# EAGLE design robotWagen_arrduino (EAGLE 9.6.2)
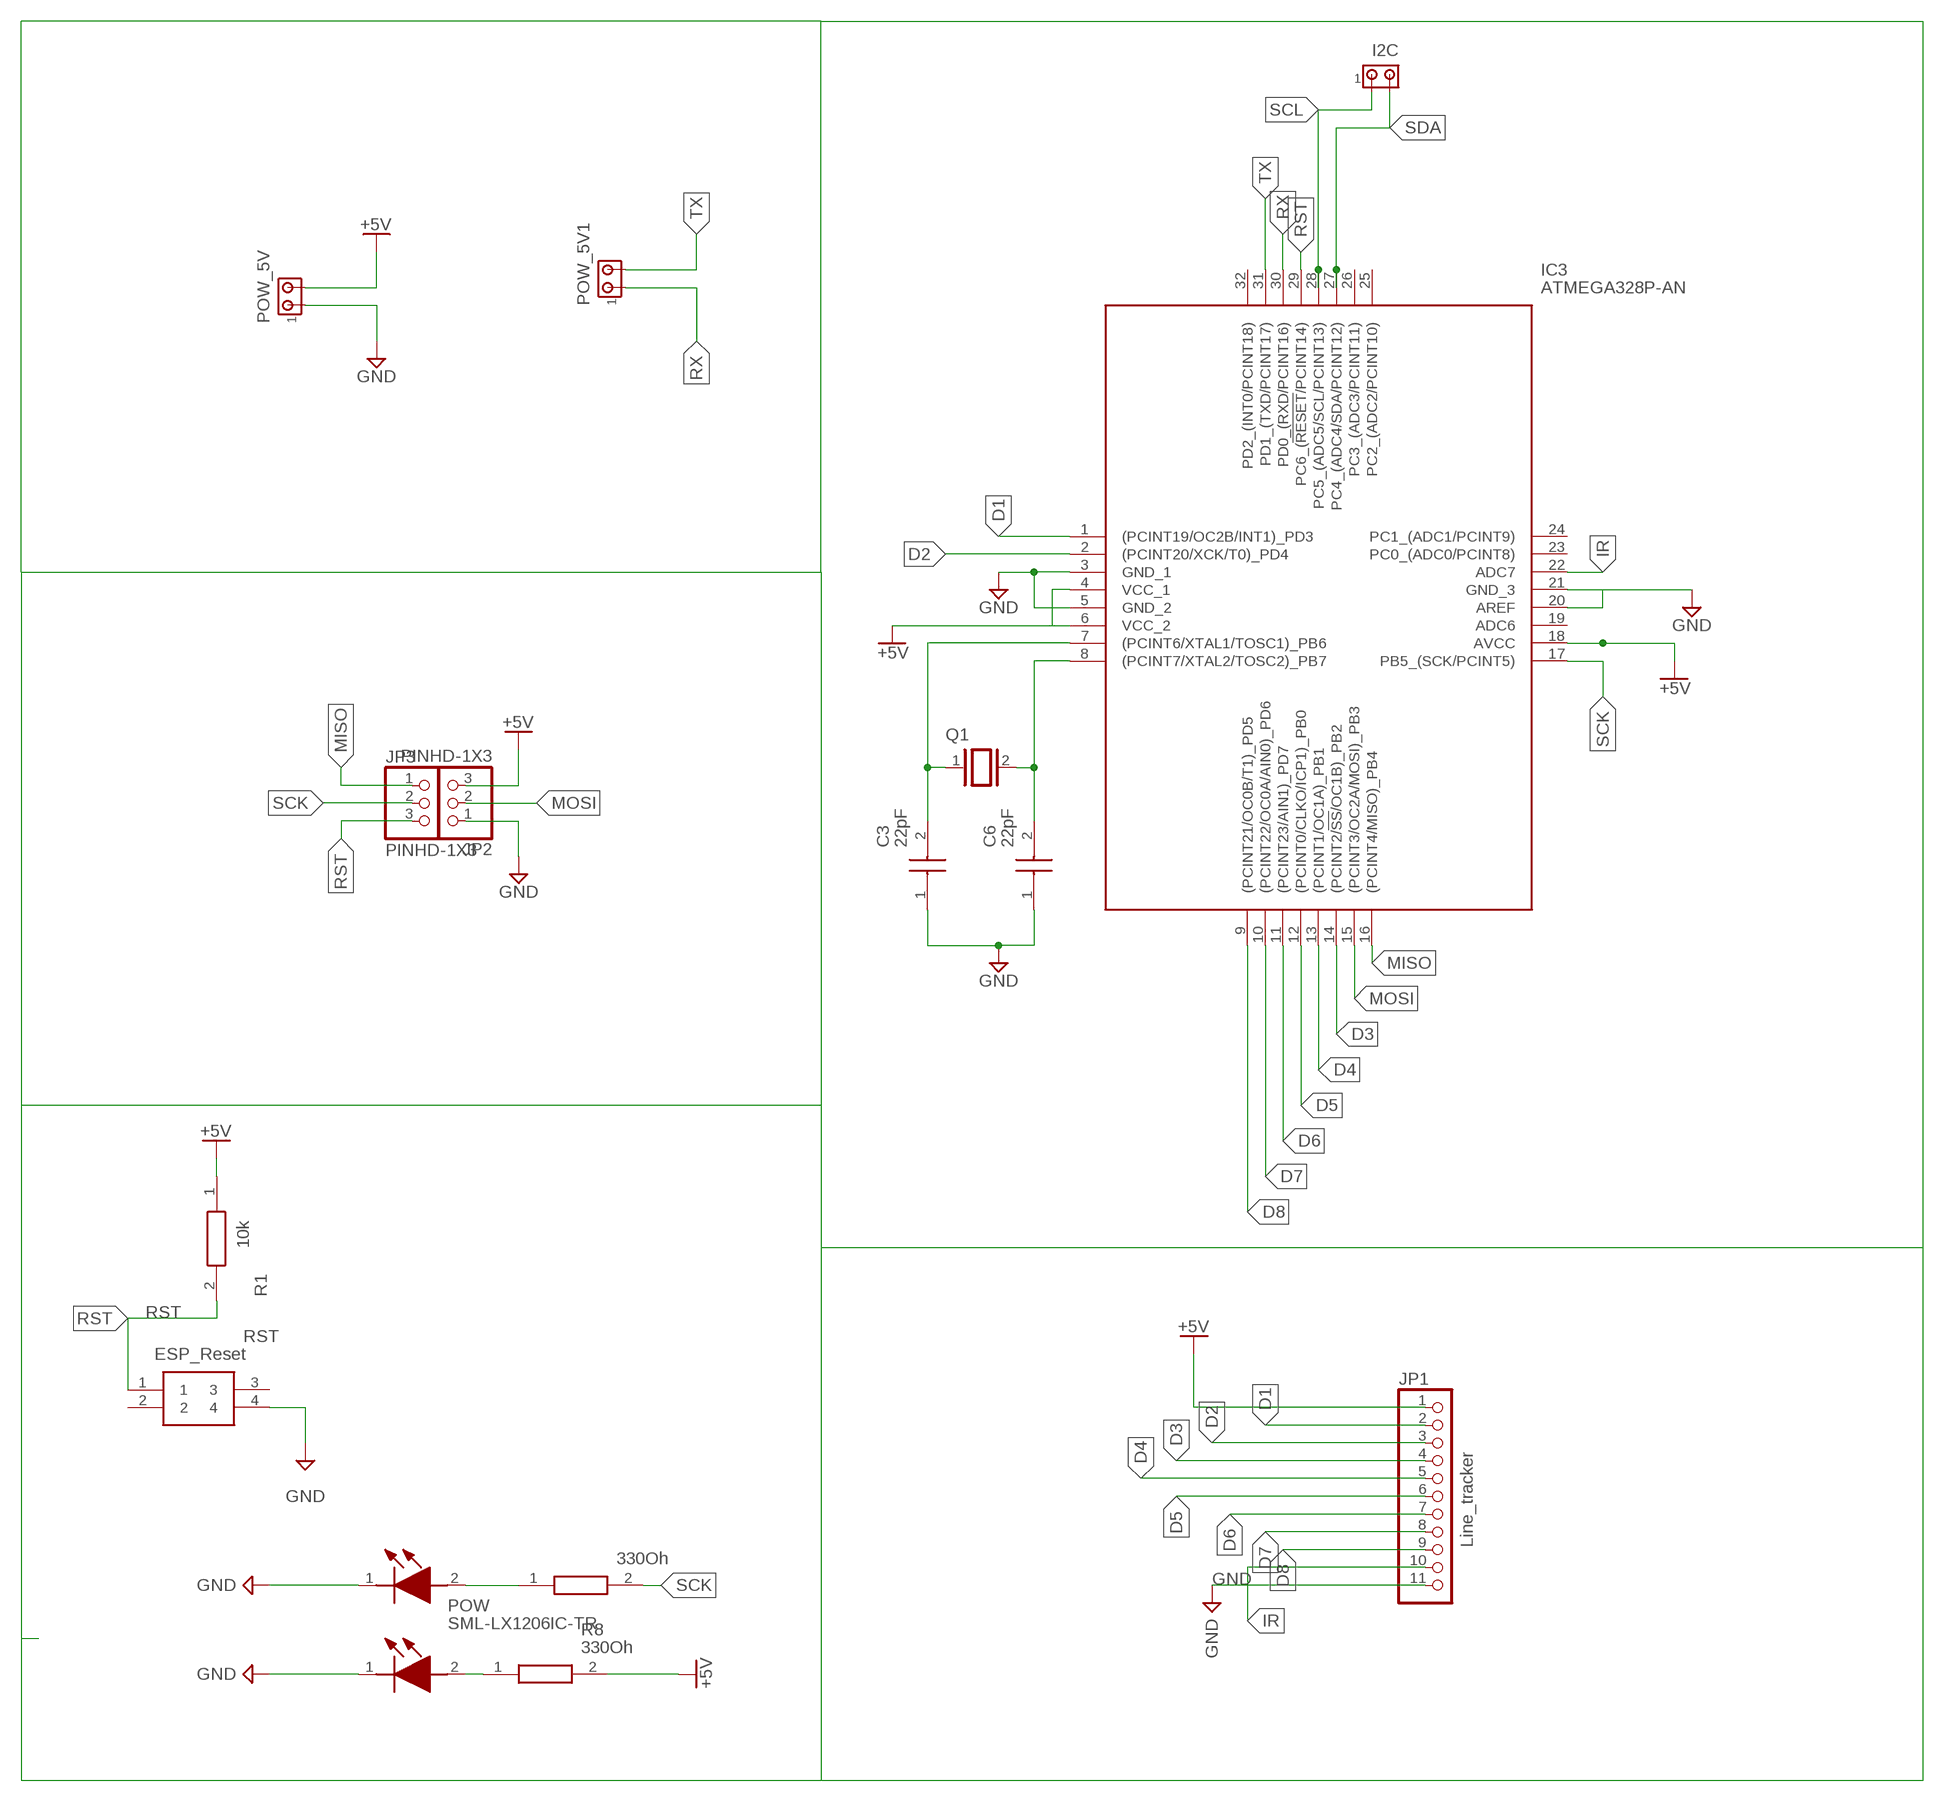
[diagram p0: schematic, sheet 1]

## Parts
C3  22pF  GRM21BR71H104JA01L  [CAPC2012X145N]
C6  22pF  GRM21BR71H104JA01L  [CAPC2012X145N]
I2C  MTA02-156  [1X2MTA]
IC3  ATMEGA328P-AN  [QFP80P900X900X120-32N]
JP1  Line_tracker  PINHD-1X11  [1X11]
JP2  PINHD-1X3  [1X03]
JP3  PINHD-1X3  [1X03]
POW  SML-LX1206IC-TR  [SMLLX1206ICTR]
POW_5V  MTA02-156  [1X2MTA]
POW_5V1  MTA02-156  [1X2MTA]
Q1  XTAL/S  [QS]
R1  10k  MCWR08X3301FTL  [RESC2012X65N]
R7  330Oh  MCWR08X3301FTL  [RESC2012X65N]
R8  330Oh  MCWR08X3301FTL  [RESC2012X65N]
RST  ESP_Reset  430182050816  [430182070816]
TX  SML-LX1206IC-TR  [SMLLX1206ICTR]

## Nets
+5V [power]: IC3.4(VCC_1) IC3.6(VCC_2) IC3.18(AVCC) JP1.1 JP2.3 POW_5V.2 R1.1 R8.2
D1: IC3.1((PCINT19/OC2B/INT1)_PD3) JP1.2
D2: IC3.2((PCINT20/XCK/T0)_PD4) JP1.3
D3: IC3.14((PCINT2/!SS!/OC1B)_PB2) JP1.4
D4: IC3.13((PCINT1/OC1A)_PB1) JP1.5
D5: IC3.12((PCINT0/CLKO/ICP1)_PB0) JP1.6
D6: IC3.11((PCINT23/AIN1)_PD7) JP1.7
D7: IC3.10((PCINT22/OC0A/AIN0)_PD6) JP1.8
D8: IC3.9((PCINT21/OC0B/T1)_PD5) JP1.9
GND [power]: C3.1 C6.1 IC3.3(GND_1) IC3.5(GND_2) IC3.20(AREF) IC3.21(GND_3) JP1.11 JP2.1 POW.1(K) POW_5V.1 RST.4 TX.1(K)
IR: IC3.22(ADC7) JP1.10
MISO: IC3.16((PCINT4/MISO)_PB4) JP3.1
MOSI: IC3.15((PCINT3/OC2A/MOSI)_PB3) JP2.2
N$2: POW.2(A) R8.1
N$3: C3.2 IC3.7((PCINT6/XTAL1/TOSC1)_PB6) Q1.1
N$5: C6.2 IC3.8((PCINT7/XTAL2/TOSC2)_PB7) Q1.2
RST: IC3.29(PC6_(!RESET!/PCINT14)) JP3.3 R1.2 RST.1
RX: IC3.30(PD0_(RXD/PCINT16)) POW_5V1.1
SCK: IC3.17(PB5_(SCK/PCINT5)) JP3.2 R7.2
SCL: I2C.1 IC3.28(PC5_(ADC5/SCL/PCINT13))
SDA: I2C.2 IC3.27(PC4_(ADC4/SDA/PCINT12))
TX: IC3.31(PD1_(TXD/PCINT17)) POW_5V1.2
TX1: R7.1 TX.2(A)
Unconnected: IC3.19(ADC6) IC3.23(PC0_(ADC0/PCINT8)) IC3.24(PC1_(ADC1/PCINT9)) IC3.25(PC2_(ADC2/PCINT10)) IC3.26(PC3_(ADC3/PCINT11)) IC3.32(PD2_(INT0/PCINT18)) RST.2 RST.3

## Library data of the parts
C3 C6 = GRM21BR71H104JA01L:GRM21BR71H104JA01L: Multilayer Ceramic Capacitors MLCC - SMD/SMT 0805 0.1uF 50volts X7R 5% Source: Datasheet <https://datasheet.datasheetarchive.com/originals/distributors/DKDS-10/192129.pdf>; ARROW_PART_NUMBER: GRM21BR71H104JA01L; ARROW_PRICE-STOCK: https://www.arrow.com/en/products/grm21br71h104ja01l/murata-manufacturing; DESCRIPTION: Multilayer Ceramic Capacitors MLCC - SMD/SMT 0805 0.1uF 50volts X7R 5%; HEIGHT: 1.45mm; MANUFACTURER_NAME: Murata Electronics; MANUFACTURER_PART_NUMBER: GRM21BR71H104JA01L; MOUSER_PART_NUMBER: 81-GRM21BR71H104JA01; MOUSER_PRICE-STOCK: https://www.mouser.co.uk/ProductDetail/Murata-Electronics/GRM21BR71H104JA01L?qs=JovLnzPPZAIJJ5OSotNa3Q%3D%3D
I2C POW_5V POW_5V1 = con-amp:MTA02-156: AMP connector
IC3 = ATMEGA328P-AN:ATMEGA328P-AN: MCU 8-bit ATmega AVR RISC 32KB Flash Atmel ATMEGA328P-AN, 8bit AVR Microcontroller, 20MHz, 32 kB Flash, 32-Pin TQFP Source: Datasheet <https://datasheet.datasheetarchive.com/originals/distributors/Datasheets_SAMA/81e6b951babeaaddc9de6b0e081ba8bf.pdf>; ARROW_PART_NUMBER: ATMEGA328P-AN; ARROW_PRICE-STOCK: https://www.arrow.com/en/products/atmega328p-an/microchip-technology?region=nac; DESCRIPTION: MCU 8-bit ATmega AVR RISC 32KB Flash Atmel ATMEGA328P-AN, 8bit AVR Microcontroller, 20MHz, 32 kB Flash, 32-Pin TQFP; HEIGHT: 1.2mm; MANUFACTURER_NAME: Microchip; MANUFACTURER_PART_NUMBER: ATMEGA328P-AN; MOUSER_PART_NUMBER: 556-ATMEGA328P-AN; MOUSER_PRICE-STOCK: https://www.mouser.co.uk/ProductDetail/Microchip-Technology-Atmel/ATMEGA328P-AN?qs=6Dg1WZIWLC6WK556tw8xAw%3D%3D
JP1 = Connector:PINHD-1X11: PIN HEADER; CATEGORY: CONNECTOR; SUB-CATEGORY: PIN-HEADER
JP2 JP3 = Connector:PINHD-1X3: PIN HEADER; CATEGORY: CONNECTOR; SUB-CATEGORY: PIN-HEADER
POW TX = SML-LX1206IC-TR:SML-LX1206IC-TR: Standard LEDs - SMD 1206 Red Source: Datasheet <http://www.farnell.com/datasheets/1856081.pdf>; ARROW_PART_NUMBER: SML-LX1206IC-TR; ARROW_PRICE-STOCK: https://www.arrow.com/en/products/sml-lx1206ic-tr/lumex?region=nac; DESCRIPTION: Standard LEDs - SMD 1206 Red; HEIGHT: 1mm; MANUFACTURER_NAME: Lumex; MANUFACTURER_PART_NUMBER: SML-LX1206IC-TR; MOUSER_PART_NUMBER: 696-SML-LX1206IC; MOUSER_PRICE-STOCK: https://www.mouser.co.uk/ProductDetail/Lumex/SML-LX1206IC-TR?qs=vlknNxX0Xzgi3577r8SRWg%3D%3D
Q1 = special:XTAL/S: CRYSTAL
R1 R7 R8 = MCWR08X3301FTL:MCWR08X3301FTL: RES, 3K3, 1%, 0.125W, 0805, THICK FILM Source: Datasheet <http://www.farnell.com/datasheets/2563624.pdf>; DESCRIPTION: RES, 3K3, 1%, 0.125W, 0805, THICK FILM; HEIGHT: 0.65mm; MANUFACTURER_NAME: MULTICOMP; MANUFACTURER_PART_NUMBER: MCWR08X3301FTL
RST = 430182050816:430182050816: Black Tactile Tactile Switch, NO 50 mA 1.6mm Surface Mount Source: Datasheet <http://katalog.we-online.de/em/datasheet/4301x2xxx8x6.pdf>; DESCRIPTION: Black Tactile Tactile Switch, NO 50 mA 1.6mm Surface Mount; HEIGHT: mm; MANUFACTURER_NAME: Wurth Elektronik; MANUFACTURER_PART_NUMBER: 430182050816; MOUSER_PART_NUMBER: 710-430182050816; MOUSER_PRICE-STOCK: https://www.mouser.co.uk/ProductDetail/Wurth-Elektronik/430182050816?qs=wr8lucFkNMUyle0jQPgWGw%3D%3D

## Net classes
1 power: width 0.254 mm, clearance 0.254 mm

## Board
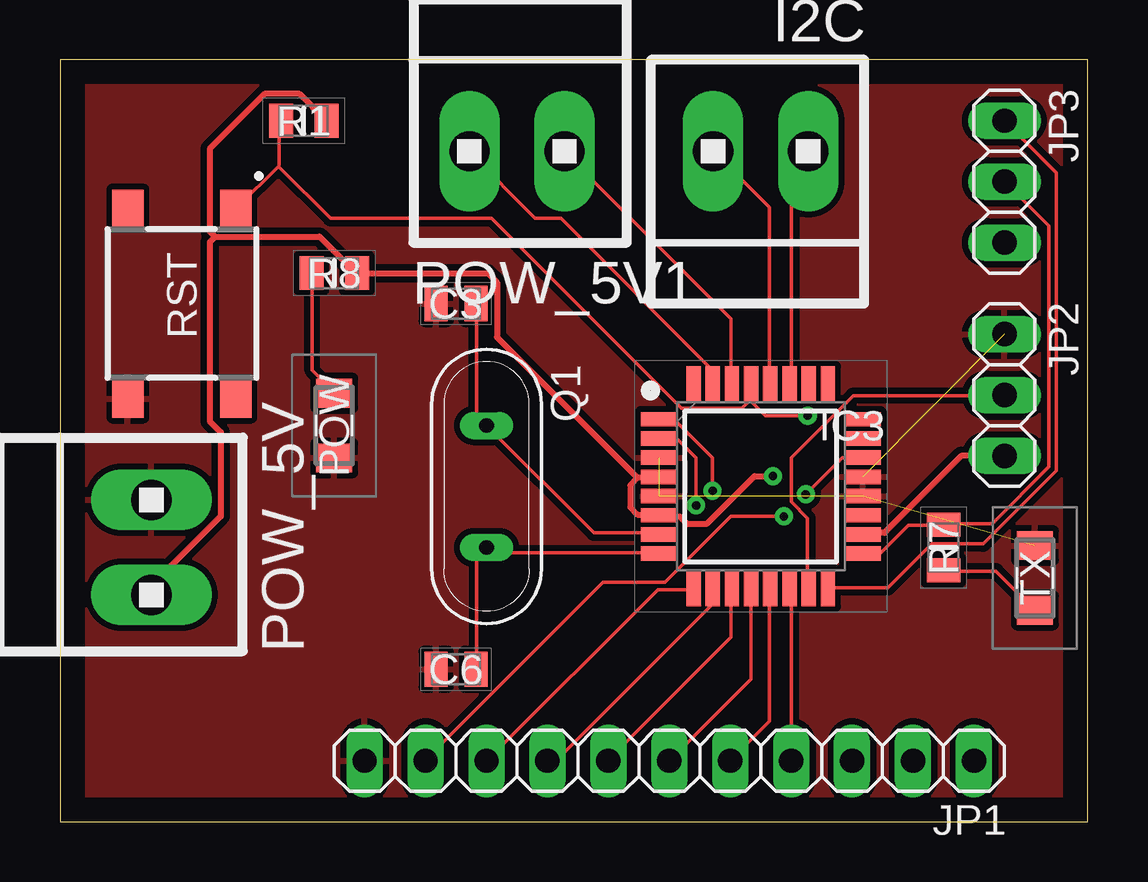
[diagram p1: board, top side]
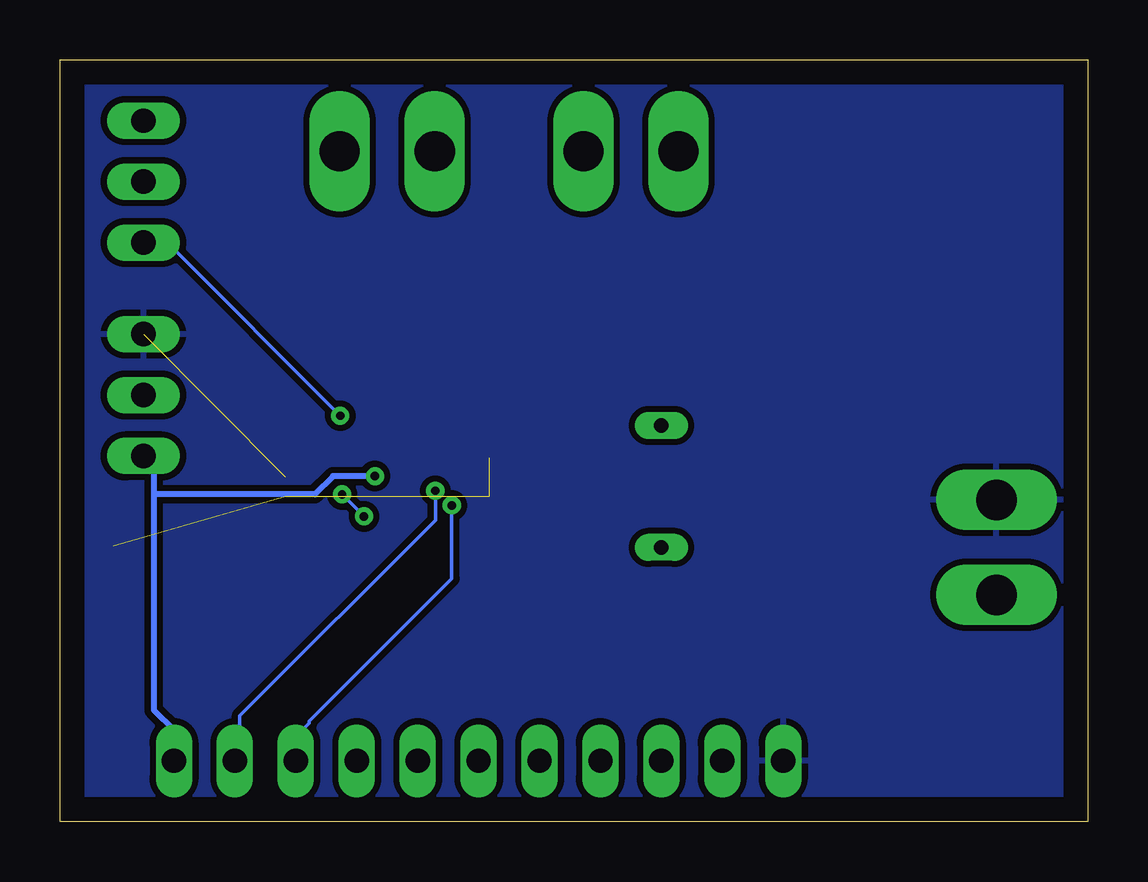
[diagram p2: board, bottom side, seen from below]

Size 42.85 x 31.74 mm. Coordinates in mm from the lower left corner, seen from the top.
Outline: 0,0 42.85,0 42.85,31.74 0,31.74 0,0
Copper layers (1*16): Top 0.035mm / dielectric 1.5mm / Bottom 0.035mm
Design rules "default": minimum track width 6mil, minimum drill 0.35mm, track to track 6mil, track to pad 6mil, pad to pad 6mil, via to via 6mil, smd to smd 6mil, copper to edge 40mil, drill to drill 6mil, minimum pad ring 10mil, minimum via ring 8mil, stop-mask expansion 4mil, vias tented up to drill 0mil, thermal gap 10mil

### Footprints (pad centres in the part's own frame; a part is rotated, then mirrored left to right if it is on the bottom)
CAPC2012X145N = smd 0.97 x 1.47: 1 -0.83,0; 2 0.83,0
1X2MTA = drill 1.676 long: 1 1.981,0; 2 -1.981,0
QFP80P900X900X120-32N = smd 1.5 x 0.6: 1 -4.25,2.8; 2 -4.25,2; 3 -4.25,1.2; 4 -4.25,0.4; 5 -4.25,-0.4; 6 -4.25,-1.2; 7 -4.25,-2; 8 -4.25,-2.8; 17 4.25,-2.8; 18 4.25,-2; 19 4.25,-1.2; 20 4.25,-0.4; 21 4.25,0.4; 22 4.25,1.2; 23 4.25,2; 24 4.25,2.8 | smd 0.6 x 1.5: 9 -2.8,-4.25; 10 -2,-4.25; 11 -1.2,-4.25; 12 -0.4,-4.25; 13 0.4,-4.25; 14 1.2,-4.25; 15 2,-4.25; 16 2.8,-4.25; 25 2.8,4.25; 26 2,4.25; 27 1.2,4.25; 28 0.4,4.25; 29 -0.4,4.25; 30 -1.2,4.25; 31 -2,4.25; 32 -2.8,4.25
1X11 = drill 1.016 long: 1 -12.7,0; 2 -10.16,0; 3 -7.62,0; 4 -5.08,0; 5 -2.54,0; 6 0,0; 7 2.54,0; 8 5.08,0; 9 7.62,0; 10 10.16,0; 11 12.7,0
1X03 = drill 1.016 long: 1 -2.54,0; 2 0,0; 3 2.54,0
SMLLX1206ICTR = smd 1.2 x 1.5: 1 -1.35,0; 2 1.35,0
QS = drill 0.61 long: 1 -2.54,0; 2 2.54,0
RESC2012X65N = smd 1 x 1.4: 1 -0.95,0; 2 0.95,0
430182070816 = smd 1.55 x 1.3: 1 -3.975,2.25; 2 -3.975,-2.25; 3 3.975,2.25; 4 3.975,-2.25

### Placement (x,y rotation side)
C3  16.51,21.59 0 top
C6  16.51,6.35 0 top
I2C  29.21,27.94 180 top
IC3  29.21,13.97 0 top
JP1  25.4,2.54 180 top
JP2  39.37,17.78 270 top
JP3  39.37,26.67 270 top
POW  11.43,16.51 90 top
POW_5V  3.81,11.43 90 top
POW_5V1  19.05,27.94 0 top
Q1  17.78,13.97 270 top
R1  10.16,29.21 180 top
R7  36.83,11.43 90 top
R8  11.43,22.86 0 top
RST  5.08,21.59 270 top
TX  40.64,10.16 270 top

### Tracks (layer width: path | path; a pad name or v marks a point on that pad's centre or on a via)
+5V  (via drill 0.35)
  Top 0.254: IC3.18 33.53,12.04 34.37,12.04 37.57,15.24 39.32,15.24 JP2.3 | 24.08,14.33 23.77,14.02 23.77,13.11 24.08,12.8 24.92,12.8 IC3.6 25.07,12.72 25.83,12.72 26.14,12.42 26.98,12.42 28.96,14.4 v29.72,14.4 | 24.08,14.33 24.92,14.33 IC3.4 | 6.48,24.38 10.82,24.38 12.34,22.86 R8.2 12.5,22.86 17.83,22.86 18.21,22.48 18.21,20.19 24,14.4 24.08,14.33 | 6.48,24.38 6.25,24.61 6.25,28.04 8.53,30.33 9.98,30.33 11.05,29.26 R1.1 | POW_5V.2 3.81,9.83 6.71,12.72 6.71,16.23 6.25,16.69 6.25,24.16 6.4,24.31 6.48,24.38
  Bottom 0.254: 38.94,13.64 38.94,14.86 39.32,15.24 JP2.3 | 38.94,13.64 38.94,4.65 38.1,3.81 38.1,2.59 JP1.1 | v29.72,14.4 31.47,14.4 32.23,13.64 38.86,13.64 38.94,13.64
D1  (via drill 0.35)
  Top 0.152: v27.2,13.79 27.2,15.16 25.6,16.76 24.99,16.76 IC3.1
  Bottom 0.152: v27.2,13.79 27.2,12.57 35.36,4.42 35.36,4.04 35.51,3.89 35.51,2.59 JP1.2
D2  (via drill 0.35)
  Top 0.152: v26.52,13.18 26.52,15.16 25.76,15.93 24.99,15.93 IC3.2
  Bottom 0.152: v26.52,13.18 26.52,10.13 32.46,4.19 32.46,4.12 32.99,3.58 32.99,2.59 JP1.3
D3
  Top 0.152: IC3.14 30.48,9.68 30.48,2.59 JP1.4
D4
  Top 0.152: IC3.13 29.57,9.68 29.57,4.19 27.96,2.59 JP1.5
D5
  Top 0.152: IC3.12 28.8,9.68 28.8,5.94 25.45,2.59 JP1.6
D6
  Top 0.152: IC3.11 27.96,9.68 27.96,7.7 22.86,2.59 JP1.7
D7
  Top 0.152: IC3.10 27.2,9.68 27.2,9.07 20.73,2.59 20.34,2.59 JP1.8
D8
  Top 0.152: IC3.9 26.36,9.68 24.92,9.68 17.83,2.59 JP1.9
GND  (4 unrouted)
  pour Top: 0,0 43.18,0 43.18,31.75 0,31.75
  pour Bottom: 0,0 43.18,0 43.18,31.75 0,31.75
IR  (via drill 0.35)
  Top 0.152: v31.09,13.64 32.61,15.16 IC3.22 | v30.18,12.72 27.96,12.72 25.22,9.98 22.63,9.98 15.24,2.59 JP1.10
  Bottom 0.152: v30.18,12.72 v31.09,13.64
MISO
  Top 0.152: IC3.16 32.08,9.75 34.52,9.75 36.35,11.58 38.48,11.58 41.53,14.63 41.53,27.05 39.4,29.18 JP3.1
MOSI
  Top 0.152: IC3.15 31.17,9.75 31.17,12.65 30.48,13.34 30.48,15.16 33.07,17.75 39.32,17.75 JP2.2
N$2
  Top 0.152: R8.1 10.52,22.86 10.52,18.82 11.43,17.91 POW.2
N$3
  Top 0.152: C3.2 17.37,21.57 17.37,16.92 17.75,16.54 Q1.1 17.83,16.46 22.25,12.04 24.92,12.04 IC3.7
N$5
  Top 0.152: C6.2 17.37,6.4 17.37,11.05 17.75,11.43 Q1.2 17.83,11.43 18.06,11.2 24.92,11.2 IC3.8
RST  (via drill 0.35)
  Top 0.152: 9.11,27.32 7.39,25.6 RST.1 | 9.11,27.32 9.14,27.36 9.14,29.18 R1.2 | 9.11,27.32 9.14,27.28 11.28,25.15 17.98,25.15 25.91,17.22 28.42,17.22 28.8,17.6 IC3.29 28.8,17.53 29.41,16.92 v31.17,16.92
  Bottom 0.152: v31.17,16.92 38.33,24.08 39.32,24.08 JP3.3
RX
  Top 0.152: IC3.30 27.96,18.29 27.96,20.95 21.03,27.89 POW_5V1.1
SCK
  Top 0.152: IC3.17 33.53,11.2 34.21,11.2 35.36,12.34 36.8,12.34 R7.2 36.88,12.42 38.86,12.42 41.22,14.78 41.22,24.84 39.4,26.67 JP3.2
SCL
  Top 0.152: IC3.28 29.57,18.29 29.57,25.6 27.28,27.89 I2C.1
SDA
  Top 0.152: IC3.27 30.48,18.29 30.48,27.2 31.17,27.89 I2C.2
TX
  Top 0.152: IC3.31 27.2,18.29 27.2,18.82 20.88,25.15 19.81,25.15 17.07,27.89 POW_5V1.2
TX1
  Top 0.152: R7.1 36.88,10.44 39.01,10.44 40.62,8.84 TX.2